# Altium schematic sheet rocketavionic.SchDoc
size A4; Date: 17.01.2023; Revision: BA; SheetNumber: 1; Project_Name: Algan_Roket_Takımı_Ana_Aviyonik_Sistem
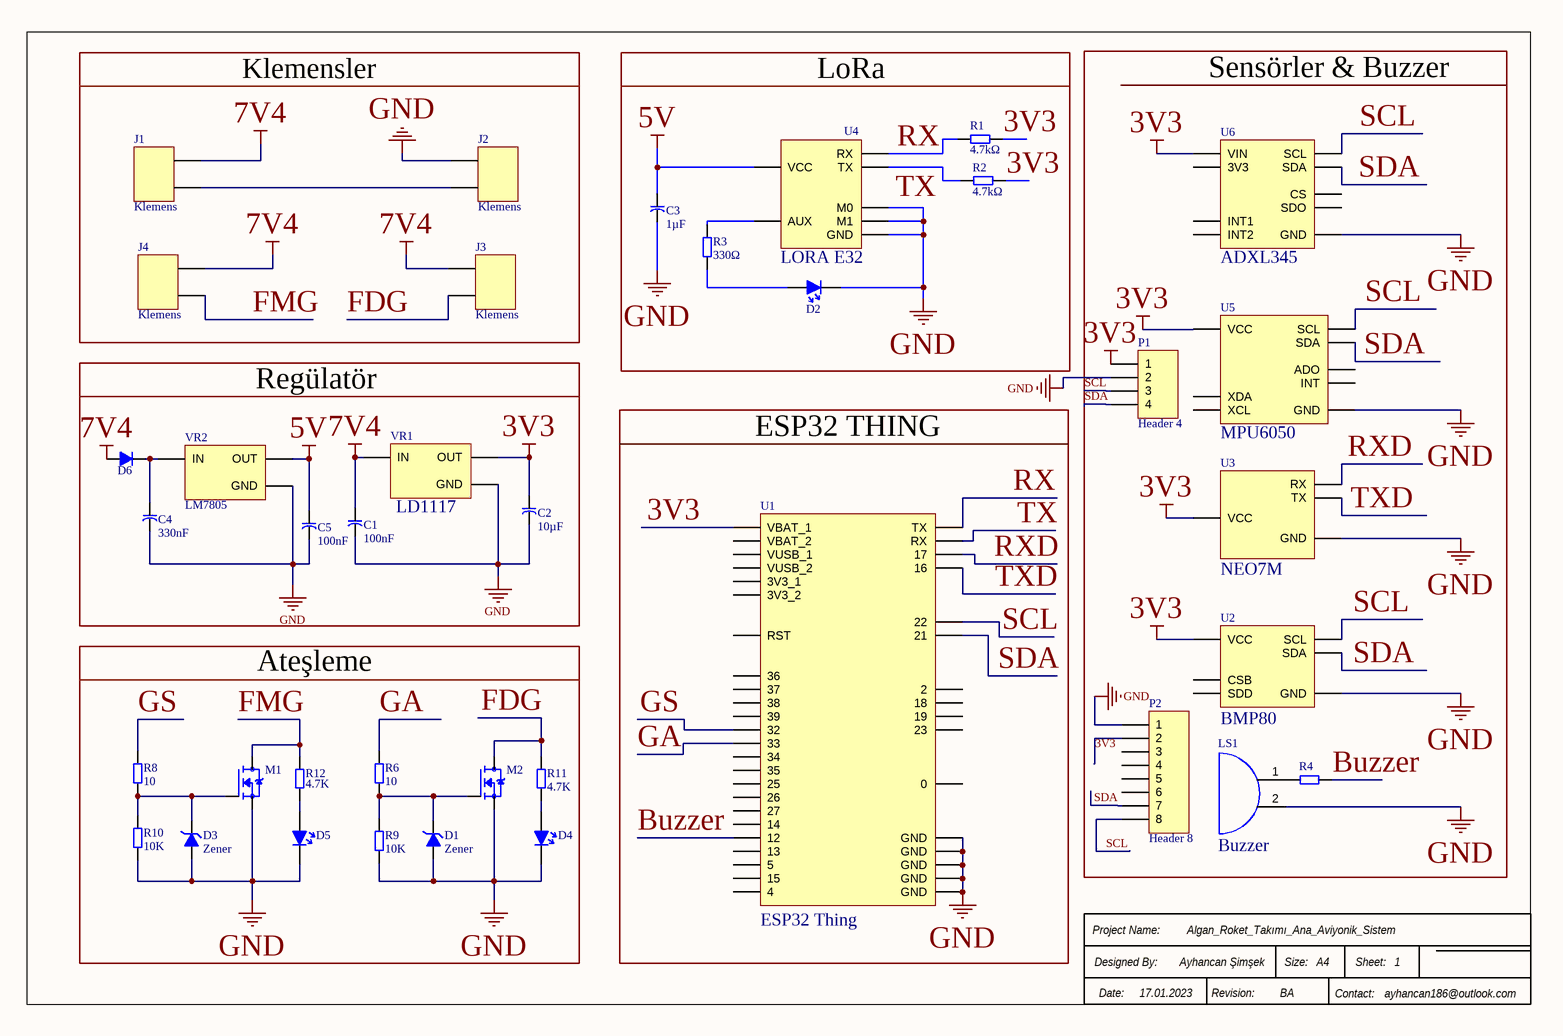
[diagram p0: rocketavionic.SchDoc]

## Parts
C1  100nF  [Capacitor]
C2  10µF  [Capacitor]
C3  1µF  [Capacitor]
C4  330nF  [Capacitor]
C5  100nF  [Capacitor]
D1  Zener  [Zener]
D2  Led  [LED]  (value not drawn)
D3  Zener  [Zener]
D4  Led  [LED]  (value not drawn)
D5  Led  [LED]  (value not drawn)
D6  e  [Zener]  (value not drawn)
J1  Klemens  [Klemens]
J2  Klemens  [Klemens]
J3  Klemens  [Klemens]
J4  Klemens  [Klemens]
LS1  Buzzer  [Buzzer]
M1  IRFZ44NPB  [MOSFET]  (value not drawn)
M2  IRFZ44NPB  [MOSFET]  (value not drawn)
P1  Header 4  [HDR1X4]
P2  Header 8  [HDR1X8]
R1  4.7kΩ  [Resistor]
R2  4.7kΩ  [Resistor]
R3  330Ω  [Resistor]
R4  Resistor  [Resistor]  (value not drawn)
R6  10  [Resistor]
R8  10  [Resistor]
R9  10K  [Resistor]
R10  10K  [Resistor]
R11  4.7K  [Resistor]
R12  4.7K  [Resistor]
U1  ESP32 Thing  [ESP32 THING]
U2  BMP80  [BMP280]
U3  NEO7M  [NEO6MV2]
U4  LORA E32  [LORAE32]
U5  MPU6050  [MPU6050]
U6  ADXL345  [ADXL345]
VR1  LD1117  [LD1117]
VR2  LM7805  [LM7805]

## Blocks framed on the sheet
Klemensler: J1-J4
LoRa: C3 D2 R1-R3 U4
Sensörler & Buzzer: LS1 P1 P2 R4 U2 U3 U5 U6
Regülatör: C1 C2 C4 C5 D6 VR1 VR2
ESP32 THING: U1
Ateşleme: D1 D3-D5 M1 M2 R6 R8-R12

## Nets
3V3: C2.1 P1.1 P2.2 R1.2 R2.2 U1.VBAT_1 U2.1(VCC) U3.1(VCC) U5.1(VCC) U6.0(VIN) VR1.2(OUT)
5V: C3.1 C5.1 U4.2(VCC) VR2.3(OUT)
7V4: C1.1 D6.1 J1.0 J3.0 J4.0 VR1.1(IN)
GND: C1.2 C2.2 C3.2 C4.2 C5.2 D1.1 D2.1 D3.1 D4.1 D5.1 J2.1 LS1.2 M1.3(S) M2.3(S) P1.2 P2.1 R9.2 R10.2 U1.GND_1(GND) U1.GND_2(GND) U1.GND_3(GND) U1.GND_4(GND) U1.GND_5(GND) U2.2(GND) U3.4(GND) U4.1(GND) U4.6(M1) U4.7(M0) U5.2(GND) U6.7(GND) VR1.3(GND) VR2.2(GND)
Buzzer: R4.2 U1.12
FDG: J3.1 M2.2(D) R11.1
FMG: J4.1 M1.2(D) R12.1
GA: R6.2 U1.33
GS: R8.2 U1.32
RX: R1.1 U1.TX U4.5(RX)
RXD: U1.17 U3.2(RX)
SCL: P1.3 P2.8 U1.22 U2.3(SCL) U5.3(SCL) U6.4(SCL)
SDA: P1.4 P2.7 U1.21 U2.4(SDA) U5.4(SDA) U6.5(SDA)
TX: R2.1 U1.RX U4.4(TX)
TXD: U1.16 U3.3(TX)
NetC4_1: C4.1 D6.2 VR2.1(IN)
NetD1_2: D1.2 M2.1(G) R6.1 R9.1
NetD2_2: D2.2 R3.1
NetD3_2: D3.2 M1.1(G) R8.1 R10.1
NetD4_2: D4.2 R11.2
NetD5_2: D5.2 R12.2
NetJ1_1: J1.1 J2.0
NetLS1_1: LS1.1 R4.1
NetR3_2: R3.2 U4.3(AUX)

Not connected (* = marked no-connect by the designer): P2 3 4 5 6; U1 0 2 3V3_1 3V3_2 4 5 13 14 15 18 19 23 25 26 27 34 35 36 37 38 39 RST VBAT_2 VUSB_1 VUSB_2; U2 5(CSB) 6(SDD); U5 5(XDA) 6(XCL) 7(ADO) 8(INT); U6 1(3V3) 2(INT1) 3(INT2) 6(CS) 8(SDO)

## Notes on the sheet
- Date:
- Project Name:
- Designed By:
- Ayhancan Şimşek
- Revision:
- Size:
- A4
- Contact:
- Sheet:
- ayhancan186@outlook.com

## Library data of the parts
C1-C5 = DCapacitor
D6 = Diode
P1 = Header 4: Header, 4-Pin; LatestRevisionDate: 17-Jul-2002; LatestRevisionNote: Re-released for DXP Platform.; Publisher: Altium Limited
P2 = Header 8: Header, 8-Pin; LatestRevisionDate: 17-Jul-2002; LatestRevisionNote: Re-released for DXP Platform.; Publisher: Altium Limited
R1-R3 R6 R8-R12 = Resistor
U1 = ESP32 Thing: ESP32 802.11 Wireless LAN/Combo Wireless Module Development Kit; Manufacturer: SparkFun; Manufacturer Part Number: DEV-13907; Frequency: 2.4GHz; Supplier 1: Digi-Key; RoHS: No; Category: RF Semiconductors and Devices; Stock 1: 568; Pricing 1: 1=23,50000 (USD); ComponentLink1URL: https://github.com/sparkfun/ESP32_Thing?src-supplier=Digi-Key; ComponentLink1Description: https://github.com/sparkfun/ESP32_Thing?src-supplier=Digi-Key; Supplier Part Number 1: 1568-1444-ND
U2 = BMP80: Washer; #2 Screw Clr; 3/32 ID; 1/4 OD; 1/32 Height; Nylon; Manufacturer: Bosch; Output Type: SPI,I2C; Pressure Type: Absolute; Operating Pressure: 15.95PSI; Port Style: No Port; Max Pressure: 290.08PSI; Sensor Type: Temperature; Interface: I2C,SPI; Evaluation Kit: Yes; Supplier 1: Future Electronics; Manufacturer Part Number: BMP280; RoHS: No; Category: Pressure Sensors; Case/Package: SMD/SMT; Number of Pins: 8; Min Operating Temperature: -40°C; Max Operating Temperature: 85°C; Termination: SMD/SMT; Lead Free: Lead Free; ComponentLink1URL: https://ae-bst.resource.bosch.com/media/_tech/media/datasheets/BST-BMP280-DS001.pdf?src-supplier=Digi-Key; ComponentLink1Description: https://ae-bst.resource.bosch.com/media/_tech/media/datasheets/BST-BMP280-DS001.pdf?src-supplier=Digi-Key; Supplier Part Number 1: BMP280; Supplier 2: Mouser; Stock 2: 658; Pricing 2: 1=14,95000, 10=14,95000, 50=14,95000, 100=14,95000, 1000=14,95000, 10000=14,95000 (USD); Package Quantity: 1; ComponentLink2URL: http://www.mouser.com/ds/2/737/adafruit-bme280-humidity-barometric-pressure-tempe-740823.pdf?src-supplier=Mouser; ComponentLink2Description: http://www.mouser.com/ds/2/737/adafruit-bme280-humidity-barometric-pressure-tempe-740823.pdf?src-supplier=Mouser; ComponentLink3URL: https://learn.adafruit.com/downloads/pdf/adafruit-bme280-humidity-barometric-pressure-temperature-sensor-breakout.pdf?src-supplier=Digi-Key; ComponentLink3Description: https://learn.adafruit.com/downloads/pdf/adafruit-bme280-humidity-barometric-pressure-temperature-sensor-breakout.pdf?src-supplier=Digi-Key; Supplier Part Number 2: 485-2652
U3 = NEO6MV2: U#NEO-6M Gps Module U-BLOX6 SMD24P; Manufacturer: u-blox; Manufacturer Part Number: NEO-6M-0; Supplier 1: Mouser; RoHS: Yes; Stock 1: 236; Pricing 1: 1=60,00000, 10=41,87000, 50=27,23000, 100=17,72000, 1000=17,72000, 10000=17,72000 (USD); RoHS Compliant: Yes; Supplier Part Number 1: 377-NEO-6M-0
U4 = LORA E32: WiFi-Modul 802.11/BT 2, 4-2, 5GHz 150Mb/s; Manufacturer: Espressif Systems; Manufacturer Part Number: ESP32-S3-WROOM-1-N16R8; Supplier 1: Digi-Key; RoHS: No; Category: Uncategorized; Stock 1: 327; Pricing 1: 1=4,29000 (USD); Supplier Part Number 1: 1965-ESP32-S3-WROOM-1-N16R8CT-ND
U5 = MPU6050: IMU ACCEL/GYRO 3-AXIS I2C 24QFN; Manufacturer: TDK InvenSense; Sensor Type: Accelerometer,Gyroscope,3 Axis; Supplier 1: Digi-Key; Manufacturer Part Number: MPU-6050; RoHS: Yes; Category: Inertial Measurement Units (IMUs); Pricing 1: 1=9,11000, 5=7,99200, 10=7,19300, 25=6,39400, 50=5,91440, 100=5,11520, 500=4,79550, 1000=4,47580 (USD); Mount: Surface Mount; Case/Package: QFN; Min Operating Temperature: -40°C; Max Operating Temperature: 85°C; Packaging: Tape and Reel; Output Type: I2C; Series: -; RoHS Compliant: Yes; ComponentLink1URL: https://datasheet.ciiva.com/1513/1788002-1513632.pdf?src-supplier=Element14; ComponentLink1Description: https://datasheet.ciiva.com/1513/1788002-1513632.pdf?src-supplier=Element14; ComponentLink2URL: https://datasheet.ciiva.com/22731/1788002-22731434.pdf?src-supplier=Element14; ComponentLink2Description: https://datasheet.ciiva.com/22731/1788002-22731434.pdf?src-supplier=Element14; Supplier Part Number 1: 1428-1007-1-ND
U6 = ADXL345: Accelerometer Triple ±2/±4/±8/±16g 2V to 3.6V 14-Pin LGA T/R; Manufacturer: Analog Devices; Manufacturer Part Number: ADXL345TCCZ-EP-RL7; Bandwidth: 0.05Hz; Interface: I2C,SPI; -3db Bandwidth: 1.6kHz; Nominal Supply Current: 140uA; Operating Supply Current: 145uA; Output Type: Digital; Axis: X, Y, Z; Sensitivity: 256LSB/g; Supplier 1: Arrow Electronics; RoHS: Yes; Category: Accelerometers; Stock 1: 2453; Pricing 1: 1=27,95650, 10=25,23100, 25=24,01200, 100=21,50500, 250=20,60800, 500=19,03250, 1000=17,99750 (USD); Case/Package: LGA; Number of Pins: 14; Contact Plating: Tin,Matte; Min Operating Temperature: -40°C; Max Operating Temperature: 85°C; Max Supply Voltage: 3.6V; Min Supply Voltage: 2V; Package Quantity: 1500; Packaging: Tape and Reel; Lead Free: Contains Lead; ComponentLink1URL: https://datasheet.ciiva.com/3275/adxl345-ep-3275833.pdf?src-supplier=Avnet; ComponentLink1Description: https://datasheet.ciiva.com/3275/adxl345-ep-3275833.pdf?src-supplier=Avnet; Supplier Part Number 1: ADXL345TCCZ-EP-RL7
VR1 = LD1117: LDO Regulator Pos 3.3V 1.3A 3-Pin(3+Tab) TO-220 Tube (Alt: LD1117V33C); Manufacturer: STMicroelectronics; Number of Outputs: 1; Max Input Voltage: 15V; Max Power Dissipation: 12W; Polarity: Positive; Quiescent Current: 10mA; Accuracy: 1%; Output Type: Fixed; Output Current: 800mA; Dropout Voltage: 1.1V; Input Bias Current: 5mA; Supplier 1: Digi-Key; Manufacturer Part Number: LD1117V33C; RoHS: Yes; Category: Voltage Regulators - Linear; Stock 1: 30; Pricing 1: 1=0,84000, 10=0,74000, 25=0,69520, 100=0,56750, 250=0,52708, 500=0,44860, 1000=0,37030 (USD); Mount: Through Hole; Case/Package: TO; Number of Pins: 3; Weight: 0.02lb; Min Operating Temperature: -40°C; Max Operating Temperature: 125°C; Output Voltage: 3.3V; Max Output Current: 1.3A; Packaging: Rail/Tube; Number of Regulators: 1; Package Quantity: 50; Nominal Output Voltage: 3.3V; Power Dissipation: 12W; Min Output Voltage: 3.3V; Output Voltage Accuracy: 1%; Series: -; Length: 10.4mm; Width: 4.6mm; Height: 9.15mm; Radiation Hardening: No; RoHS Compliant: Yes; REACH SVHC: No SVHC; Lead Free: Lead Free; ComponentLink1URL: https://datasheet.ciiva.com/1511/1776449-1511580.pdf?src-supplier=Element14; ComponentLink1Description: https://datasheet.ciiva.com/1511/1776449-1511580.pdf?src-supplier=Element14; ComponentLink2URL: https://datasheet.ciiva.com/16226/cd00000544-16226333.pdf?src-supplier=Future+Electronics; ComponentLink2Description: https://datasheet.ciiva.com/16226/cd00000544-16226333.pdf?src-supplier=Future+Electronics; ComponentLink3URL: https://datasheet.ciiva.com/2044/cd00000544-2044110.pdf?src-supplier=Digi-Key; ComponentLink3Description: https://datasheet.ciiva.com/2044/cd00000544-2044110.pdf?src-supplier=Digi-Key; Supplier Part Number 1: 497-1492-5-ND
VR2 = LM7805: LM78XX Series 5 V Fixed Output 1 A 3-Terminal LDO Voltage Regulator - TO-220; Manufacturer: ON Semiconductor / Fairchild; Manufacturer Part Number: LM7805CT; Output Voltage: 5V; Number of Outputs: 1; Max Input Voltage: 35V; Output Current: 1A; Min Input Voltage: 7V; Polarity: Positive; Dropout Voltage: 2V; Quiescent Current: 8mA; Accuracy: 4%; Power Supply Rejection Ratio (PSRR): 73dB; Max Output Voltage: 5.2V; Supplier 1: Digi-Key; RoHS: Yes; Category: Voltage Regulators - Linear; Mount: Through Hole; Case/Package: TO-220-3; Number of Pins: 3; Weight: 1.214g; Min Operating Temperature: -40°C; Max Operating Temperature: 125°C; Packaging: Rail/Tube; Output Type: Fixed; Max Output Current: 1A; Number of Regulators: 1; Output Voltage Accuracy: 4%; Package Quantity: 50; Current Rating: 1A; Nominal Output Voltage: 5V; Min Output Voltage: 5V; Length: 10.67mm; Width: 4.7mm; Height: 16.3mm; Radiation Hardening: No; RoHS Compliant: Yes; Lead Free: Lead Free; REACH SVHC: No SVHC; ComponentLink1URL: https://datasheet.ciiva.com/19456/786138-19456361.pdf?src-supplier=Jameco; ComponentLink1Description: https://datasheet.ciiva.com/19456/786138-19456361.pdf?src-supplier=Jameco; ComponentLink2URL: https://datasheet.ciiva.com/1512/1855686-1512105.pdf?src-supplier=Element14; ComponentLink2Description: https://datasheet.ciiva.com/1512/1855686-1512105.pdf?src-supplier=Element14; ComponentLink3URL: https://datasheet.ciiva.com/1512/1855686-1512106.pdf?src-supplier=Element14; ComponentLink3Description: https://datasheet.ciiva.com/1512/1855686-1512106.pdf?src-supplier=Element14; ComponentLink4URL: https://datasheet.ciiva.com/1511/1855686-1511835.pdf?src-supplier=Element14; ComponentLink4Description: https://datasheet.ciiva.com/1511/1855686-1511835.pdf?src-supplier=Element14; ComponentLink5URL: https://datasheet.ciiva.com/8239/lm7812-8239478.pdf?src-supplier=Avnet; ComponentLink5Description: https://datasheet.ciiva.com/8239/lm7812-8239478.pdf?src-supplier=Avnet; ComponentLink6URL: https://datasheet.ciiva.com/17332/lm7805-17332792.pdf?src-supplier=Future+Electronics; ComponentLink6Description: https://datasheet.ciiva.com/17332/lm7805-17332792.pdf?src-supplier=Future+Electronics; ComponentLink7URL: https://datasheet.ciiva.com/2039/lm7805-2039365.pdf?src-supplier=Digi-Key; ComponentLink7Description: https://datasheet.ciiva.com/2039/lm7805-2039365.pdf?src-supplier=Digi-Key; ComponentLink8URL: https://datasheet.ciiva.com/48694/001253095-da-01-en-ic-reg-ldo-5v-1a-lm7805ct-to-220-3-fsc-48694790.pdf?src-supplier=Conrad; ComponentLink8Description: https://datasheet.ciiva.com/48694/001253095-da-01-en-ic-reg-ldo-5v-1a-lm7805ct-to-220-3-fsc-48694790.pdf?src-supplier=Conrad; Supplier Part Number 1: LM7805CT-ND